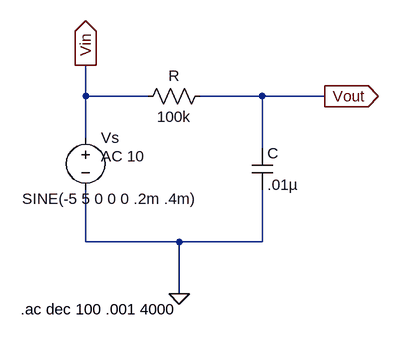
[diagram p0: schematic LowPass.asc]
LowPass.asc, the LTspice schematic file:
Version 4
SHEET 1 880 680
WIRE 32 80 32 32
WIRE 128 80 32 80
WIRE 304 80 208 80
WIRE 400 80 304 80
WIRE 32 144 32 80
WIRE 304 160 304 80
WIRE 32 304 32 224
WIRE 176 304 32 304
WIRE 304 304 304 224
WIRE 304 304 176 304
WIRE 176 384 176 304
FLAG 176 384 0
FLAG 400 80 Vout
IOPIN 400 80 Out
FLAG 32 32 Vin
IOPIN 32 32 Out
SYMBOL voltage 32 128 R0
WINDOW 123 24 44 Left 2
WINDOW 39 0 0 Left 0
WINDOW 3 -98 110 Left 2
SYMATTR Value2 AC 10
SYMATTR Value SINE(-5 5 0 0 0 .2m .4m)
SYMATTR InstName Vs
SYMBOL res 224 64 R90
WINDOW 0 0 56 VBottom 2
WINDOW 3 32 56 VTop 2
SYMATTR InstName R
SYMATTR Value 100k
SYMBOL cap 288 160 R0
SYMATTR InstName C
SYMATTR Value .01µ
TEXT -68 408 Left 2 !.ac dec 100 .001 4000

The netlist it stands for:
* LowPass.asc
Vs Vin 0 SINE(-5 5 0 0 0 .2m .4m) AC 10
R Vout Vin 100k
C Vout 0 .01µ
.ac dec 100 .001 4000
.backanno
.end